# EAGLE schematic F1E_Rev_0.9 (EAGLE 9.6.2)
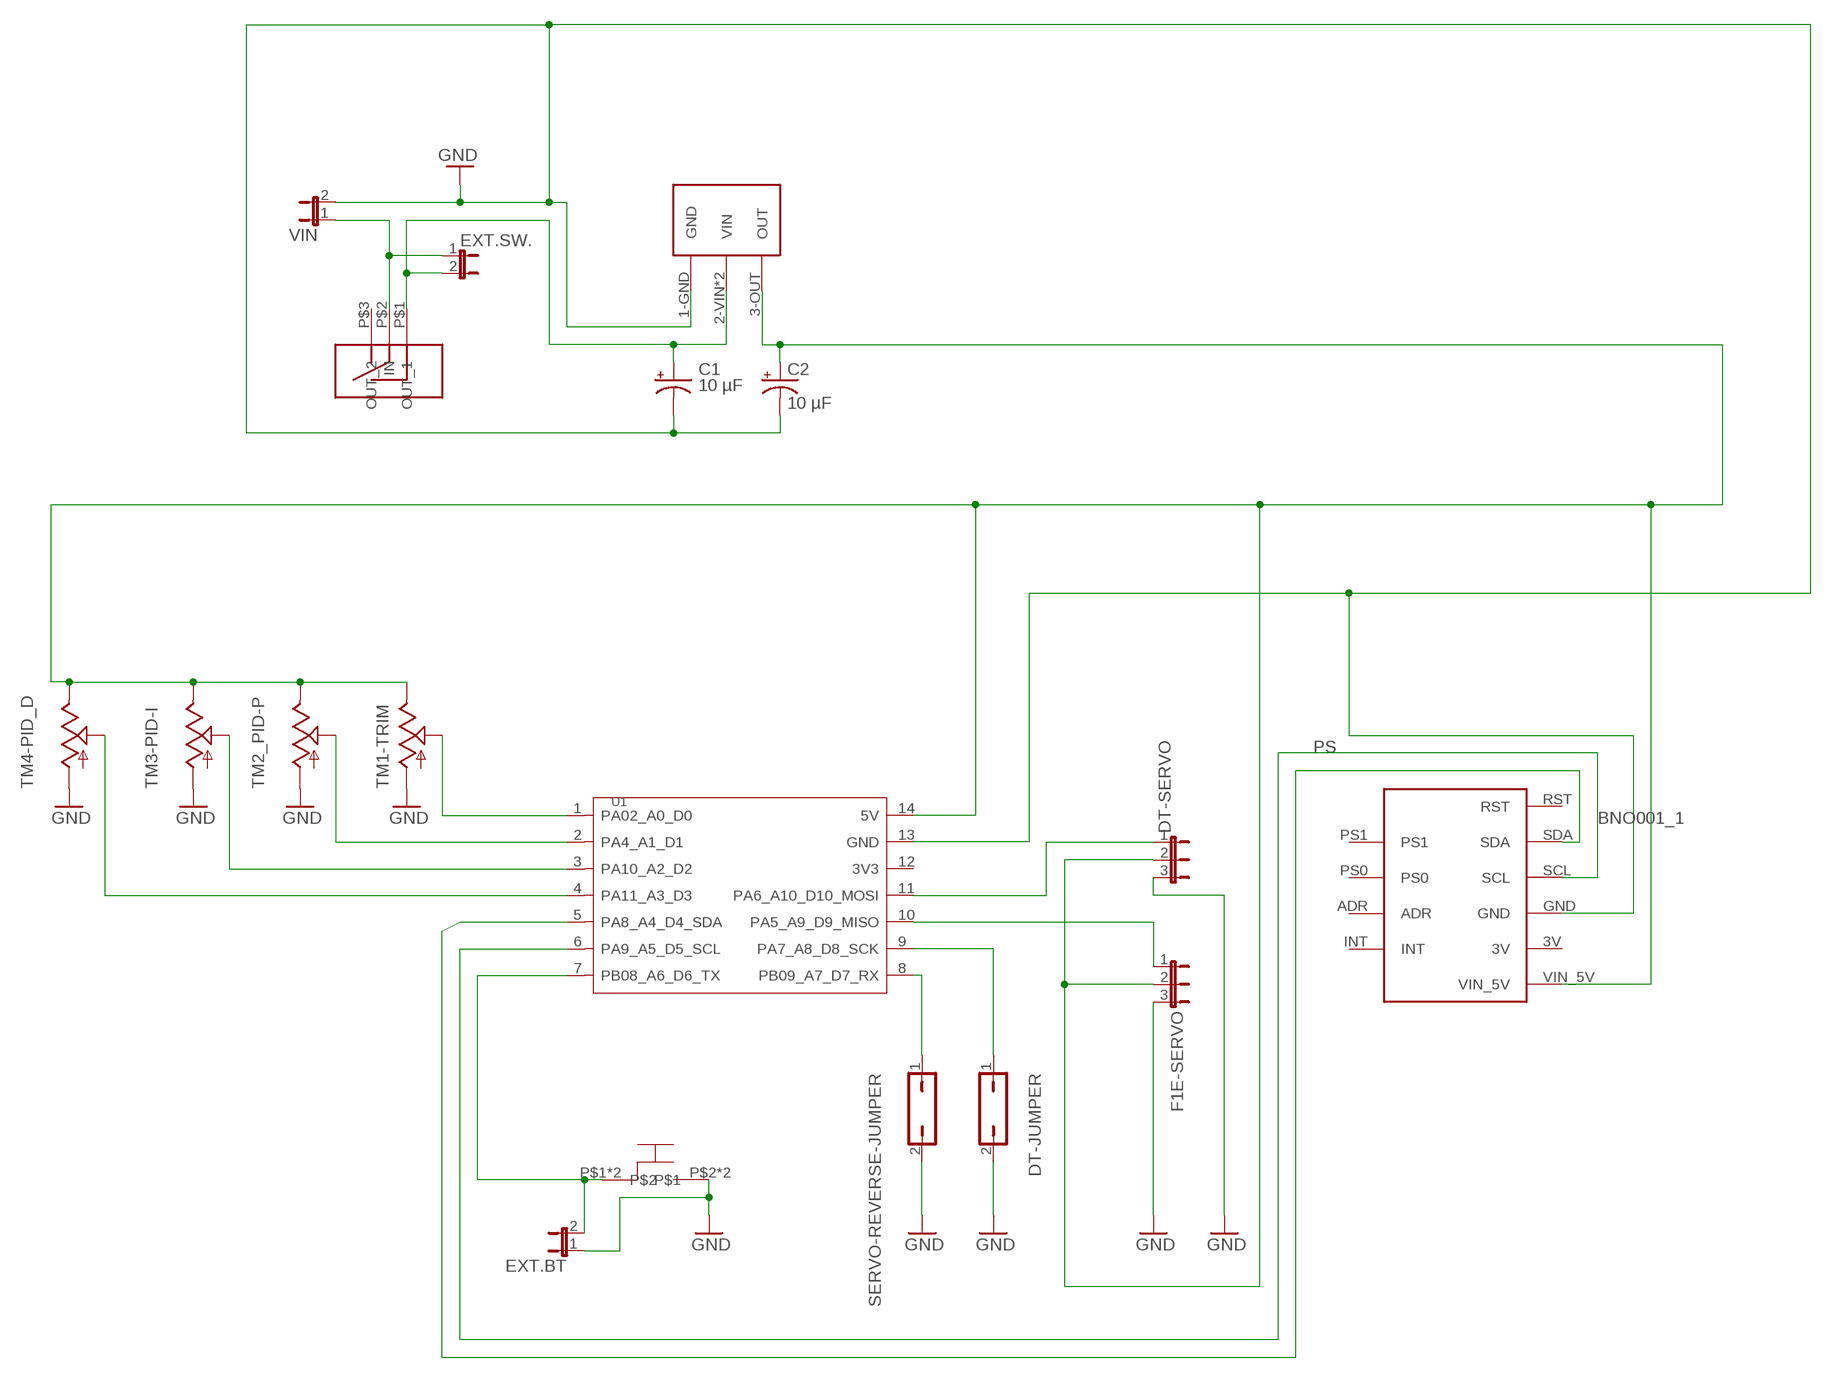
[diagram p0: schematic, sheet 1]

## Parts
BNO001_1  PS  [PS]
C1  10 µF  CPOL-US153CLV-0405  [153CLV-0405]
C2  10 µF  CPOL-US153CLV-0405  [153CLV-0405]
DT-JUMPER  JP1Q  [JP1]
DT-SERVO  JP2E  [JP2]
EXT.BT  JP1E  [JP1]
EXT.SW.  JP1E  [JP1]
F1E-SERVO  JP2W  [JP2W]
SERVO-REVERSE-JUMPER  JP1Q  [JP1]
TM1-TRIM  TRIM  [6MM]
TM2_PID-P  TRIM  [6MM]
TM3-PID-I  TRIM  [6MM]
TM4-PID_D  TRIM  [6MM]
U1  MOUDLE-SEEEDUINO-XIAO  [MOUDLE14P-2.54-21X17.8MM]
U$1  PS_HT7350_SOT89  [PS_HT7350_SOT89]
U$2  PA_BUTTON  [PS_BUTTON]
U$3  PS_PWR  [PS_PW]
VIN  JP1E  [JP1]

## Nets
GND [supply]: BNO001_1.GND C1.- C2.- DT-JUMPER.2 DT-SERVO.3 EXT.BT.1 F1E-SERVO.3 SERVO-REVERSE-JUMPER.2 TM1-TRIM.A TM2_PID-P.A TM3-PID-I.A TM4-PID_D.A U1.13(GND) U$1.1-GND(GND) U$2.P$2 U$2.P$3 VIN.2
N$1 [signal]: DT-SERVO.1 U1.11(PA6_A10_D10_MOSI)
N$2 [signal]: F1E-SERVO.1 U1.10(PA5_A9_D9_MISO)
N$3 [signal]: BNO001_1.SDA U1.5(PA8_A4_D4_SDA)
N$4 [signal]: BNO001_1.SCL U1.6(PA9_A5_D5_SCL)
N$5 [signal]: TM3-PID-I.S U1.3(PA10_A2_D2)
N$6 [signal]: TM4-PID_D.S U1.4(PA11_A3_D3)
N$7 [signal]: TM1-TRIM.S U1.1(PA02_A0_D0)
N$8 [signal]: TM2_PID-P.S U1.2(PA4_A1_D1)
N$9 [signal]: SERVO-REVERSE-JUMPER.1 U1.8(PB09_A7_D7_RX)
N$10 [signal]: DT-JUMPER.1 U1.9(PA7_A8_D8_SCK)
N$11: EXT.BT.2 U1.7(PB08_A6_D6_TX) U$2.P$1 U$2.P$4
PWR [supply]: EXT.SW..1 U$3.P$2(IN) VIN.1
PWR_1 [supply]: C1.+ EXT.SW..2 U$1.2-VIN(VIN) U$1.VIN U$3.P$1(OUT_1)
PWR_5V [supply]: BNO001_1.VIN_5V C2.+ DT-SERVO.2 F1E-SERVO.2 TM1-TRIM.E TM2_PID-P.E TM3-PID-I.E TM4-PID_D.E U1.14(5V) U$1.3-OUT(OUT)
Unconnected: BNO001_1.ADR BNO001_1.INT BNO001_1.PS0 BNO001_1.PS1 BNO001_1.RST U1.12(3V3) U$3.P$3(OUT_2)

## Power pins joined to a net without a drawn wire
3V: BNO001_1.3V

## Library data of the parts
BNO001_1 = PS:PS: BN0055 / STEMMA Connectors Build by Paul Seren 2021
C1 C2 = adafruit:CPOL-US: POLARIZED CAPACITOR, American symbol
DT-JUMPER SERVO-REVERSE-JUMPER = jumper:JP1Q: JUMPER
DT-SERVO = jumper:JP2E: JUMPER
EXT.BT EXT.SW. VIN = jumper:JP1E: JUMPER
F1E-SERVO = jumper:JP2W: JUMPER
TM1-TRIM TM2_PID-P TM3-PID-I TM4-PID_D = adafruit:TRIM
U1 = Seeeduino XIAO:MOUDLE-SEEEDUINO-XIAO
U$1 = PS_73:PS_HT7350_SOT89: Package für Voltage regulator
U$2 = PS_BUTTON:PA_BUTTON: Taster
U$3 = PS_PW:PS_PWR

## Net classes
0 default: width 0.406 mm, clearance 0.305 mm
1 signal: width 0.406 mm, clearance 0.305 mm
2 supply: width 0.61 mm, clearance 0.406 mm